# EAGLE design coulomb_counter (EAGLE 9.6.2)
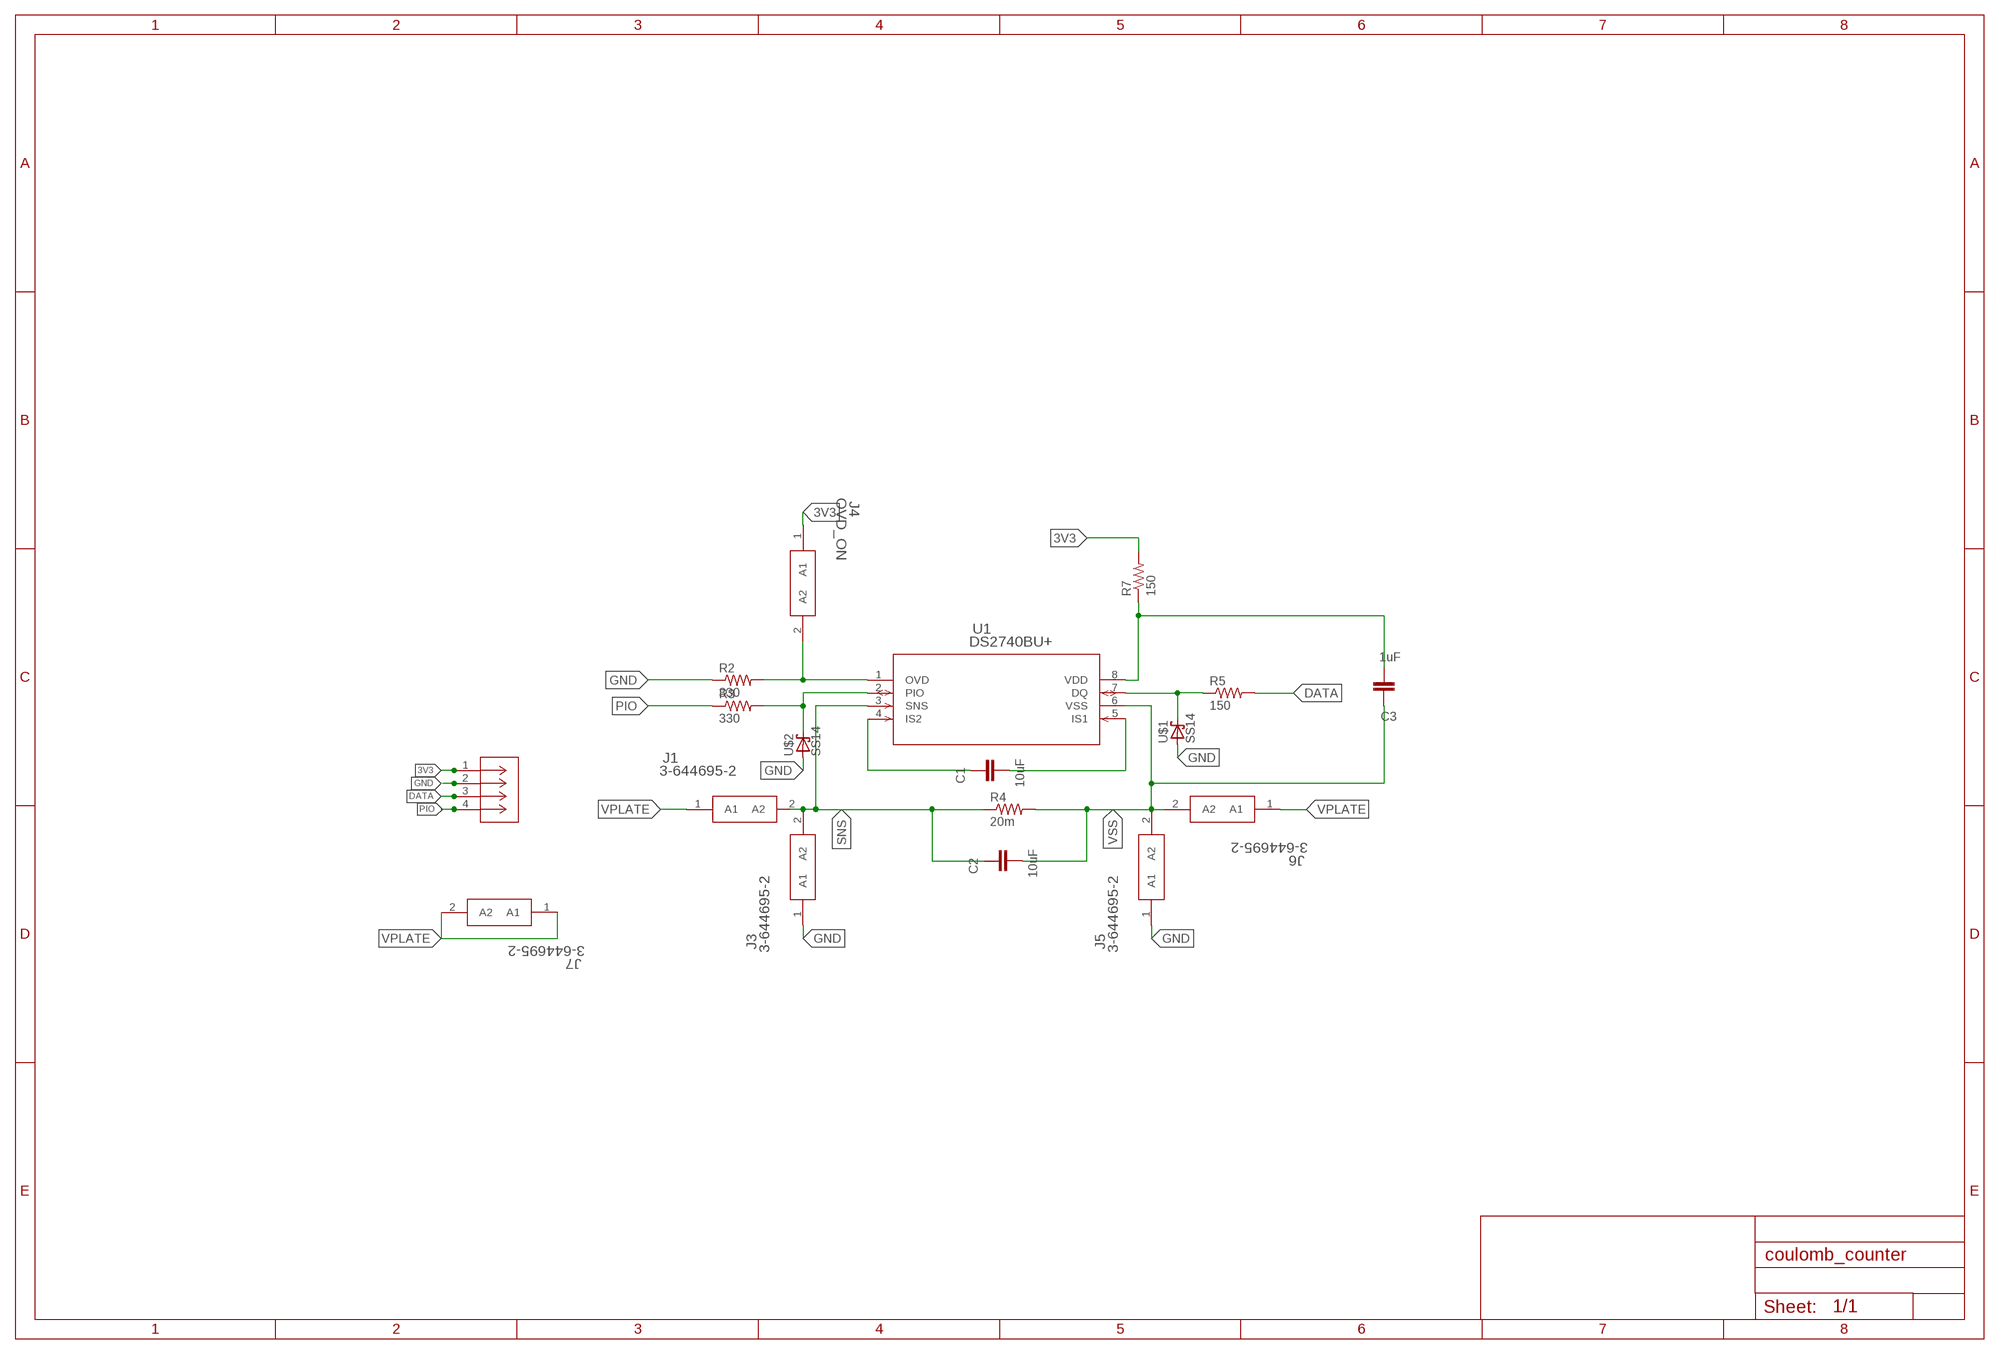
[diagram p0: schematic, sheet 1]

## Parts
C1  10uF  GRM31CR60J107ME39L  [CAP_1206]
C2  10uF  GRM31CR60J107ME39L  [CAP_1206]
C3  1uF  GRM31CR60J107ME39L  [CAP_1206]
J1  3-644695-2  [3-644695-2_TYC]
J2  1935187  [CONN_1935187_PXC]
J3  3-644695-2  [3-644695-2_TYC]
J4  OVD_ON  3-644695-2  [3-644695-2_TYC]
J5  3-644695-2  [3-644695-2_TYC]
J6  3-644695-2  [3-644695-2_TYC]
J7  3-644695-2  [3-644695-2_TYC]
R2  330  ERJ-8GEY0R00V  [RES_1206]
R3  330  ERJ-8GEY0R00V  [RES_1206]
R4  20m  ERJ-8GEY0R00V  [RES_1206]
R5  150  ERJ-8GEY0R00V  [RES_1206]
R7  150  ERJ-8GEY0R00V  [RES_1206]
U1  DS2740BU+  [21-0036K_MXM]
U$1  SS14  [DO-214AC]
U$2  SS14  [DO-214AC]

## Nets
3V3: J2.1 J4.1(A1) R7.2
DATA: J2.3 R5.2
GND: J2.2 J3.1(A1) J5.1(A1) R2.1 U$1.A U$2.A
N$1: C3.2 R7.1 U1.8(VDD)
N$2: C1.2 U1.5(IS1)
N$3: C1.1 U1.4(IS2)
N$5: R3.2 U1.2(PIO) U$2.C
N$6: R5.1 U1.7(DQ) U$1.C
OVD: J4.2(A2) R2.2 U1.1(OVD)
PIO: J2.4 R3.1
SNS: C2.1 J1.2(A2) J3.2(A2) R4.1 U1.3(SNS)
VPLATE: J1.1(A1) J6.1(A1) J7.1(A1) J7.2(A2)
VSS: C2.2 C3.1 J5.2(A2) J6.2(A2) R4.2 U1.6(VSS)

## Library data of the parts
C1-C3 = Resistor_Capacitor:GRM31CR60J107ME39L: CAP CER 100UF 6.3V X5R 1206 Manufacturer's datasheet <https://www.murata.com/~/media/webrenewal/support/library/catalog/products/capacitor/mlcc/c02e.ashx?la=en-us>; CREATED_BY: PCBLayout.com; DIGIKEY_PART_NUMBER: GRM31CR60J107ME39L; MANUFACTURER: Murata Electronics North America; MPN: GRM31CR60J107ME39L; PACKAGE: SMD 1206
J1 J3-J7 = 2pinhdr:3-644695-2; BUILT_BY: EMA_UL_Team; MANUFACTURER_PART_NUMBER: 3-644695-2; SOURCELIBRARY: Tyco_2013-08-06_AMP_MTA_644695; VENDOR: TE Connectivity
J2 = screwterm_4:1935187; ARTICLE_DESCRIPTION: PT 1,5/ 4-5,0-H; BUILT_BY: EMA_Cory; CONTACT_TYPE: Unknown; COPYRIGHT: Copyright (C) 2018 Accelerated Designs. All rights reserved; MANUFACTURER_PART_NUMBER: 1935187; NUMBER_OF_CONNECTION: 4; NUMBER_OF_POSITION_PER_ROW: 4; NUMBER_OF_POTENTIALS: 4; NUMBER_OF_ROWS: 1; NUMBER_OF_SOLDER_PINS_PER_POTENTIALS: 1; PITCH__MM_: 5; PLUG_SYSTEM: Unknown; PRODUCTTYP: Printed circuit board terminal; PRODUCT_FAMILY: PT 1,5/..-H; SOLDER_PIN_LENGTH__MM_: 3.5; SOURCELIBRARY: Phoenix_Contact_2020-03-19; VENDOR: Phoenix Contact
R2-R5 R7 = Resistor_Capacitor:ERJ-8GEY0R00V: RES SMD 0 OHM JUMPER 1/4W 1206 Manufacturer's datasheet <https://industrial.panasonic.com/ww/products/resistors/chip-resistors/general-purpose-chip-resistors/thick-film-chip-resistors/ERJ8GEY0R00V>; CREATED_BY: PCBLayout.com; DIGIKEY_PART_NUMBER: P0.0ETR-ND; MANUFACTURER: Panasonic Electronic Components; MPN: ERJ-8GEY0R00V; PACKAGE: SMD 1206
U1 = DS2740BU:DS2740BU+; BUILT_BY: EMA_UL_Team; MANUFACTURER_PART_NUMBER: ds2740bu+; REVISION: 2; SOURCELIBRARY: Maxim_2009-12-17_1; VENDOR: Maxim Integrated Products
U$1 U$2 = SS14:SS14; AVAILABILITY: Unavailable; DESCRIPTION: Diode Schottky 40V 1A Surface Mount SMA (DO-214AC); DIGIKEY-PURCHASE-URL: https://snapeda.com/shop?store=DigiKey&id=1413348; MF: ON Semiconductor; MP: SS14; PACKAGE: DO-214AC-214 ON Semiconductor; PRICE: None

## Board
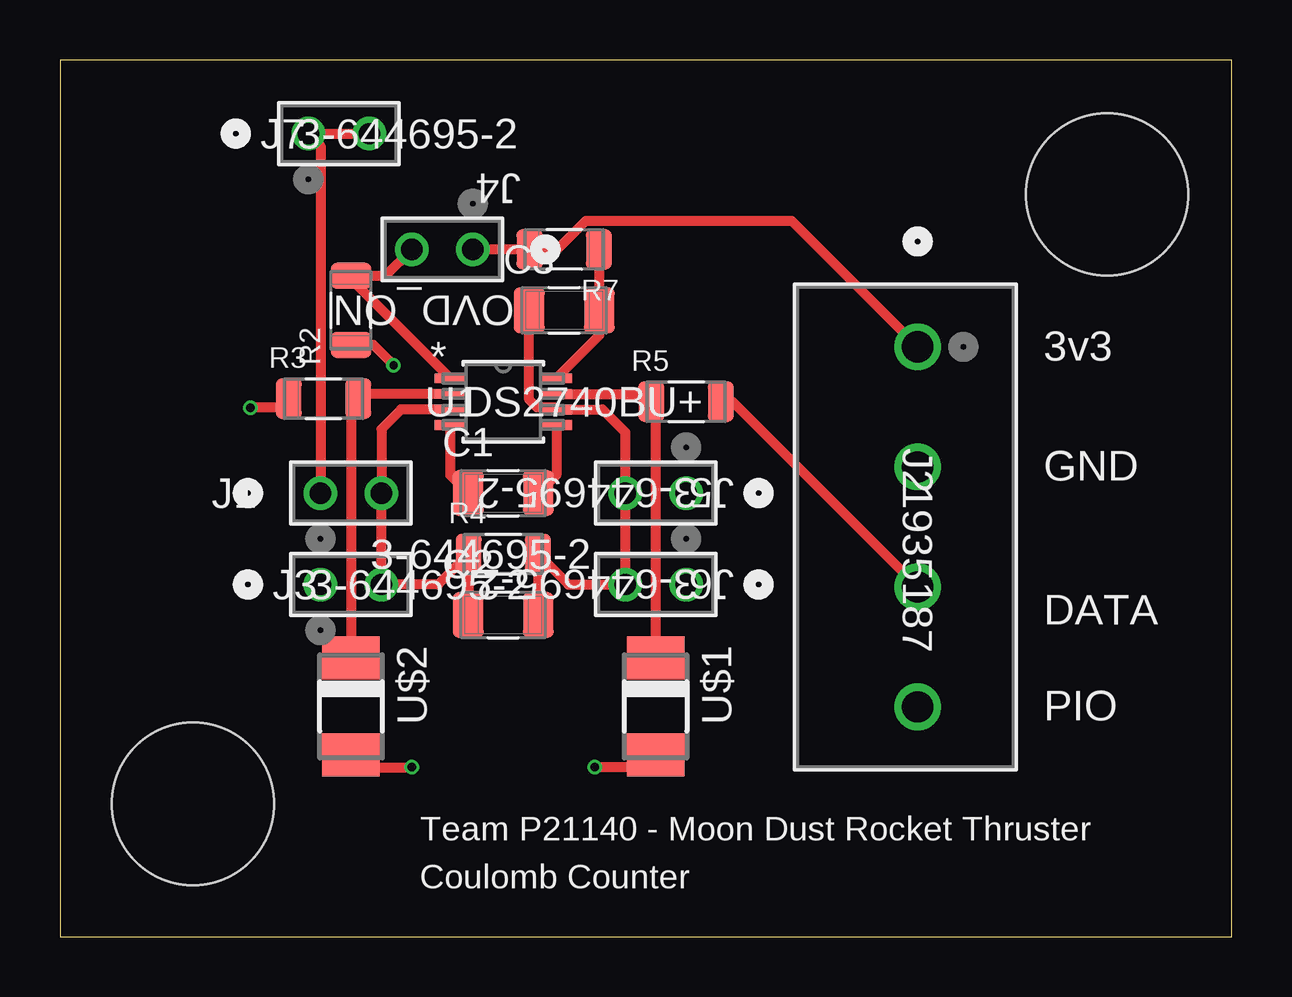
[diagram p1: board, top side]
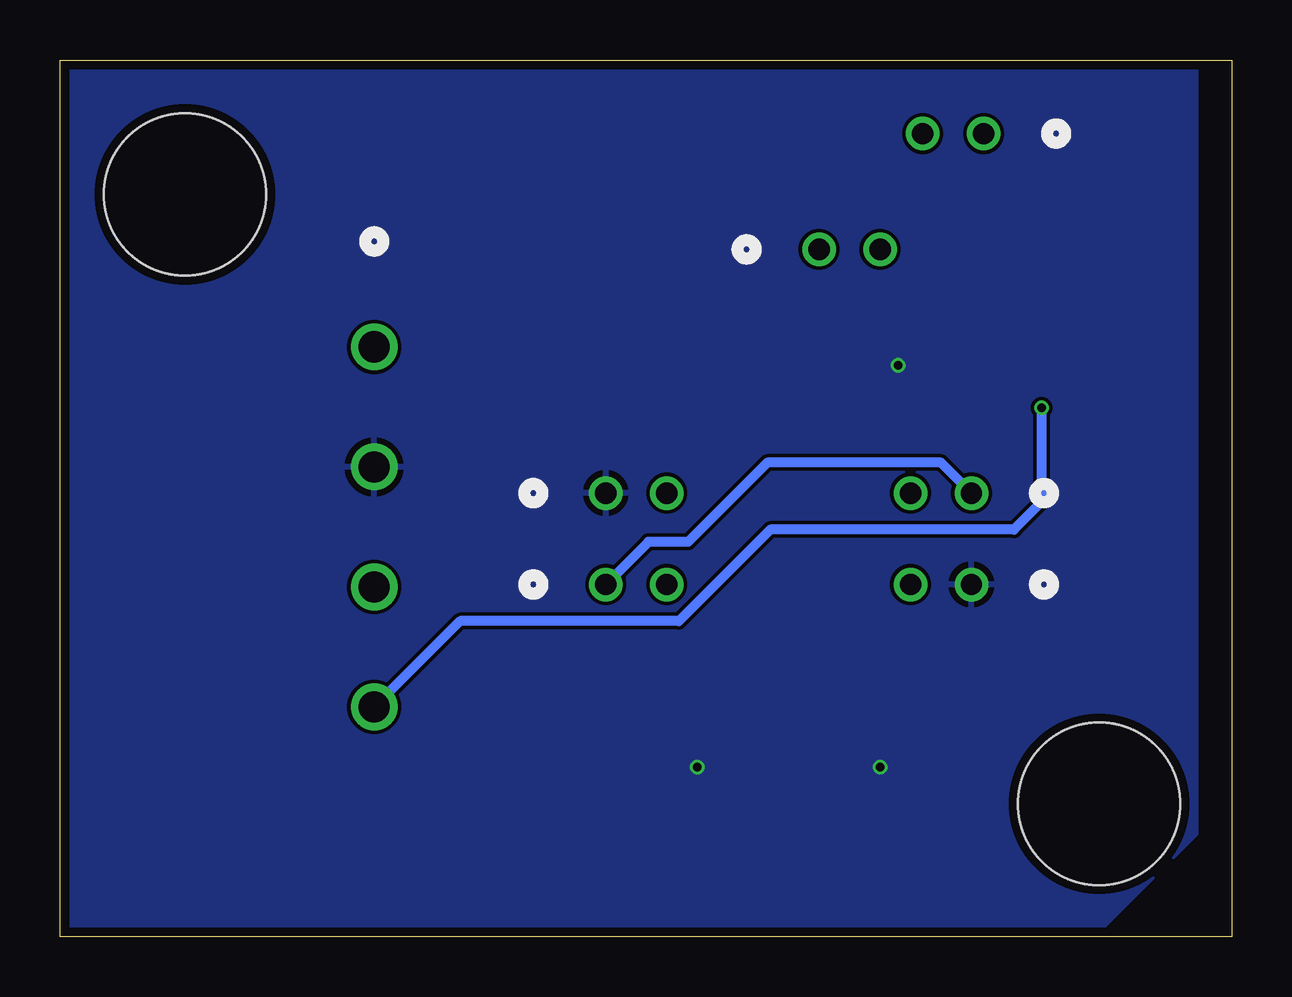
[diagram p2: board, bottom side, seen from below]

Size 48.85 x 36.55 mm. Coordinates in mm from the lower left corner, seen from the top.
Outline: 0,0 48.85,0 48.85,36.55 0,36.55 0,0
Copper layers (1*16): Top 0.035559375mm / dielectric 1.6mm / Bottom 0.035559375mm
Design rules "oshpark-2layer": minimum track width 6mil, minimum drill 10mil, track to track 6mil, track to pad 6mil, pad to pad 6mil, via to via 6mil, smd to smd 6mil, copper to edge 15mil, drill to drill 6mil, minimum pad ring 5mil, minimum via ring 5mil, stop-mask expansion 2.5mil, vias tented up to drill 0mil, thermal gap 10mil
Holes 6.76 mm at 5.54,5.54 43.64,30.94

### Footprints (pad centres in the part's own frame; a part is rotated, then mirrored left to right if it is on the bottom)
CAP_1206 = smd 1.29 x 1.91: 1 -1.46,0; 2 1.46,0
3-644695-2_TYC = drill 0.889 pad 1.397: 1 0,0; 2 2.54,0
CONN_1935187_PXC = drill 1.295 pad 1.803: 1 0,0; 2 5.004,0; 3 10.008,0; 4 15.011,0
RES_1206 = smd 1.08 x 1.68: 1 -1.445,0; 2 1.445,0
21-0036K_MXM = smd 1.321 x 0.406: 1 -2.21,0.975; 2 -2.21,0.325; 3 -2.21,-0.325; 4 -2.21,-0.975; 5 2.21,-0.975; 6 2.21,-0.325; 7 2.21,0.325; 8 2.21,0.975
DO-214AC = smd 1.8 x 2.4: A 2.025,0; C -2.025,0

### Placement (x,y rotation side)
C1  18.48,18.49 0 top
C2  18.48,13.41 0 top
C3  21.02,26.11 0 top
J1  10.86,18.49 0 top
J2  35.75,24.59 270 top
J3  10.86,14.68 0 top
J4  17.21,28.65 180 top
J5  26.1,18.49 180 top
J6  26.1,14.68 180 top
J7  10.35,33.48 0 top
R2  12.13,26.11 90 top
R3  10.98,22.43 0 top
R4  18.48,15.95 0 top
R5  26.1,22.3 0 top
R7  21.02,28.65 180 top
U1  18.48,22.3 0 top
U$1  24.83,9.6 270 top
U$2  12.13,9.6 270 top

### Tracks (layer width: path | path; a pad name or v marks a point on that pad's centre or on a via)
3V3
  Top 0.406: J4.1 R7.2 20.73,28.65 21.92,29.85 30.49,29.85 J2.1
DATA
  Top 0.406: J2.3 28.03,22.3 R5.2
GND  (via drill 0.35)
  Top 0.406: U$2.A 12.64,7.06 v14.67,7.06 | U$1.A 24.31,7.06 v22.29,7.06 | R2.1 13.06,24.67 v13.91,23.83
  pour Bottom: 1.46,10.62 1.46,38.56 5.27,42.37 49.72,42.37 52.26,39.83 52.26,4.27 48.45,0.46 5.27,0.46 1.46,4.27
N$1
  Top 0.406: U1.8 22.48,25.07 C3.2 22.46,26.13 R7.1
N$2
  Top 0.406: U1.5 20.69,19.24 C1.2
N$3
  Top 0.406: U1.4 16.27,19.24 C1.1
N$5
  Top 0.406: U$2.C 12.13,22.13 R3.2 12.63,22.63 U1.2
N$6
  Top 0.406: U1.7 24.33,22.63 R5.1 24.83,22.13 U$1.C
OVD
  Top 0.406: J4.2 13.57,27.56 R2.2 12.13,27.42 U1.1
PIO  (via drill 0.35)
  Top 0.406: R3.1 9.16,22.05 v7.93,22.05
  Bottom 0.406: v7.93,22.05 7.93,18.12 9.08,16.97 19.24,16.97 23.05,13.16 32.17,13.16 J2.4
SNS
  Top 0.406: U1.3 14.22,21.98 13.4,21.16 J1.2 J3.2 15.76,14.68 R4.1 17.03,13.43 C2.1
VPLATE
  Top 0.406: J7.2 J7.1 10.86,32.97 J1.1
  Bottom 0.406: J1.1 12.13,19.76 19.37,19.76 22.67,16.46 24.32,16.46 J6.1
VSS
  Top 0.406: C2.2 19.92,13.43 R4.2 21.19,14.68 J6.2 J5.2 23.56,21.03 22.61,21.98 U1.6 20.6,22.07 19.88,22.07 19.56,22.39 C3.1

### Text on the board
tNames: 3v3 | GND | DATA | PIO | Team P21140 - Moon Dust Rocket Thruster | Coulomb Counter